# EAGLE design Tiny 5 Stick PTH -v2 (EAGLE 6.4)
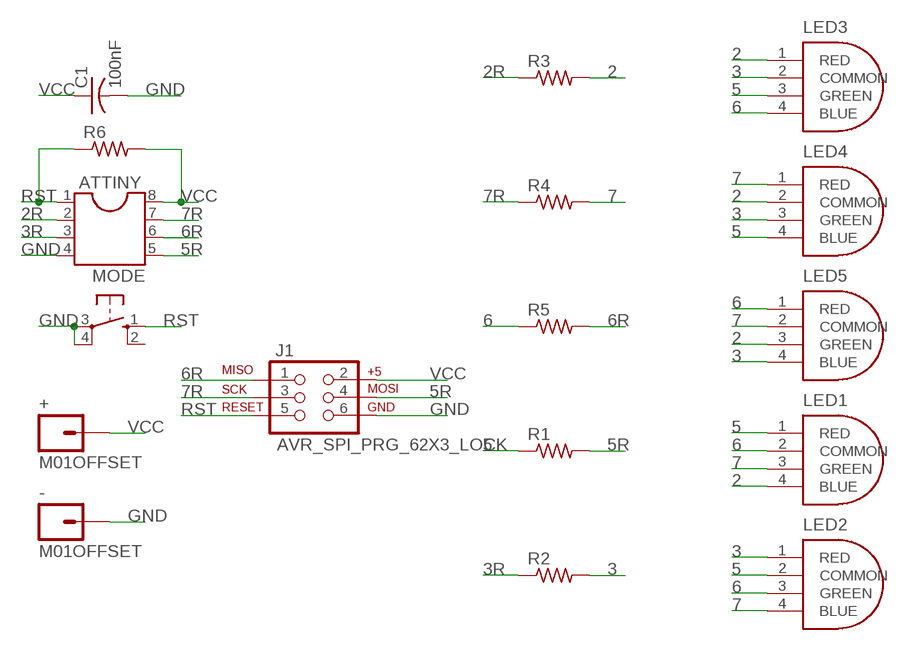
[diagram p0: schematic, sheet 1]

## Parts
+  M01OFFSET  [1X01_OFFSET]
-  M01OFFSET  [1X01_OFFSET]
ATTINY  DIL8S  [SOCKET-08]
C1  100nF  C-US025-025X050  [C025-025X050]
J1  AVR_SPI_PRG_62X3_LOCK  [2X3_LOCK]
LED1  10MM-RGB-LEDSEEED  [10MM-RGB-LED-SEEED-VALID]
LED2  10MM-RGB-LEDSEEED  [10MM-RGB-LED-SEEED-VALID]
LED3  10MM-RGB-LEDSEEED  [10MM-RGB-LED-SEEED-VALID]
LED4  10MM-RGB-LEDSEEED  [10MM-RGB-LED-SEEED-VALID]
LED5  10MM-RGB-LEDSEEED  [10MM-RGB-LED-SEEED-VALID]
MODE  10-XX  [B3F-10XX]
R1  R-US_0207/7  [0207/7]
R2  R-US_0207/7  [0207/7]
R3  R-US_0207/7  [0207/7]
R4  R-US_0207/7  [0207/7]
R5  R-US_0207/7  [0207/7]
R6  R-US_0207/2V  [0207/2V]

## Nets
2: LED1.4(BLUE) LED3.1(RED) LED4.2(COMMON) LED5.3(GREEN) R3.2
2R: ATTINY.2 R3.1
3: LED2.1(RED) LED3.2(COMMON) LED4.3(GREEN) LED5.4(BLUE) R2.2
3R: ATTINY.3 R2.1
5: LED1.1(RED) LED2.2(COMMON) LED3.3(GREEN) LED4.4(BLUE) R1.1
5R: ATTINY.5 J1.4 R1.2
6: LED1.2(COMMON) LED2.3(GREEN) LED3.4(BLUE) LED5.1(RED) R5.1
6R: ATTINY.6 J1.1 R5.2
7: LED1.3(GREEN) LED2.4(BLUE) LED4.1(RED) LED5.2(COMMON) R4.2
7R: ATTINY.7 J1.3 R4.1
GND: -.1 ATTINY.4 C1.2 J1.6 MODE.3(P) MODE.4(P1)
RST: ATTINY.1 J1.5 MODE.1(S) R6.1
VCC: +.1 ATTINY.8 C1.1 J1.2 R6.2
Unconnected: MODE.2(S1)

## Library data of the parts
+ - = SparkFun:M01: Header 1 Standard 1-pin 0.1" header. Use with straight break away headers (SKU : PRT-00116), right angle break away headers (PRT-00553), swiss pins (PRT-00743), machine pins (PRT-00117), and female headers (PRT-00115).
ATTINY = ic-package:DIL8: Dual In Line / Socket
C1 = adafruit:C-US: CAPACITOR, American symbol
J1 = SparkFun-Connectors:AVR_SPI_PRG_6: AVR ISP 6 Pin This is the reduced ISP connector for AVR programming. Common on Arduino. This footprint will take up less PCB space and can be used with a 10-pin to 6-pin adapter such as SKU: BOB-08508
LED1-LED5 = 00_rgbled:10MM-RGB-LED
MODE = switch-omron:10-XX: OMRON SWITCH; MPN: B3F-1000; OC_FARNELL: 176432; OC_NEWARK: 36M3542
R1-R6 = 00_PERSONAL:R-US_: RESISTOR, American symbol

## Net classes
0 default: clearance 0.355 mm

## Board
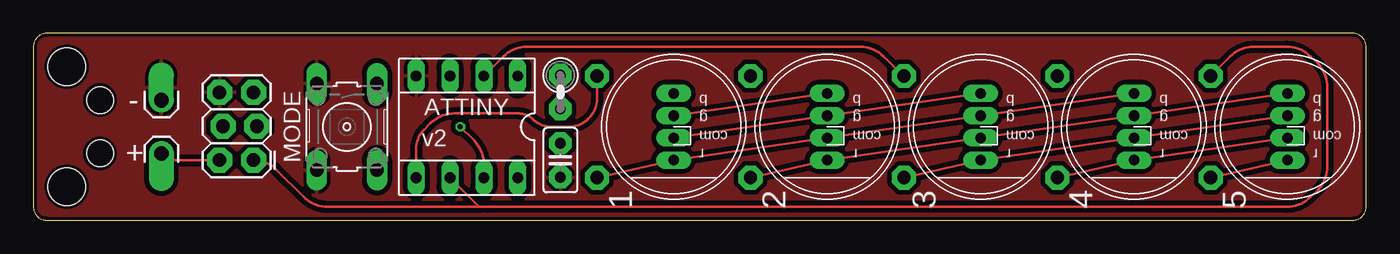
[diagram p1: board, top side]
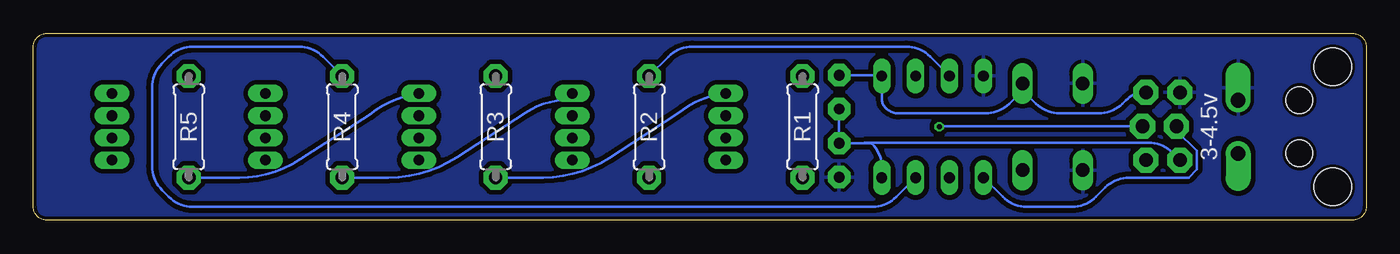
[diagram p2: board, bottom side, seen from below]

Size 99.9 x 14 mm. Coordinates in mm from the lower left corner, seen from the top.
Outline: 1,0 98.9,0 arc90 99.9,1 99.9,13 arc90 98.9,14 1,14 arc90 0,13 0,1 arc90 1,0
Copper layers (1*16): Top 0.035mm / dielectric 1.5mm / Bottom 0.035mm
Design rules "Fusion_eagle_rule_v1.1": minimum track width 6mil, minimum drill 12mil, track to track 6mil, track to pad 6mil, pad to pad 6mil, via to via 6mil, smd to smd 0mil, copper to edge 10mil, drill to drill 10mil, minimum pad ring 10mil, minimum via ring 6mil, stop-mask expansion 2mil, vias tented up to drill 100mil, thermal gap 10mil
Holes 2 mm at 5,5 5,9
Holes 2.8 mm at 2.5,2.5 2.5,11.5

### Footprints (pad centres in the part's own frame; a part is rotated, then mirrored left to right if it is on the bottom)
1X01_OFFSET = drill 1.118 pad 1.88 offset: 1 0,0
SOCKET-08 = drill 0.813 long: 1 -3.81,-3.81; 2 -1.27,-3.81; 3 1.27,-3.81; 4 3.81,-3.81; 5 3.81,3.81; 6 1.27,3.81; 7 -1.27,3.81; 8 -3.81,3.81
C025-025X050 = drill 0.813 pad 1.676 octagon: 1 -1.27,0; 2 1.27,0
2X3_LOCK = drill 1.016 pad 1.88 octagon: 1 0,0; 2 0,2.54; 3 2.54,-0.254; 4 2.54,2.286; 5 5.08,0; 6 5.08,2.54
10MM-RGB-LED-SEEED-VALID = drill 0.8 pad 0.889 long: 1 2.496,0; 2 0.832,0; 3 -0.832,0; 4 -2.496,0
B3F-10XX = drill 1.016 long: 1 -3.251,2.261; 2 3.251,2.261; 3 -3.251,-2.261; 4 3.251,-2.261
0207/7 = drill 1 pad 1.778 octagon: 1 -3.81,0; 2 3.81,0
0207/2V = drill 0.813 pad 1.676 octagon: 1 -1.27,0; 2 1.27,0

### Placement (x,y rotation side)
+  9.6,5 180 top
-  9.6,9 0 top
ATTINY  32.5,7 180 top
C1  39.5,4.5 270 top
J1  16.5,4.5 90 top
LED1  48,7 270 top
LED2  59.5,7 270 top
LED3  71,7 270 top
LED4  82.5,7 270 top
LED5  94,7 270 top
MODE  23.5,7 270 top
R1  42.25,7 90 bottom
R2  53.75,7 270 bottom
R3  65.25,7 270 bottom
R4  76.75,7 270 bottom
R5  88.25,7 90 bottom
R6  39.5,9.6 270 top

### Tracks (layer width: path | path; a pad name or v marks a point on that pad's centre or on a via)
2
  Top 0.203: R3.2 LED3.1 LED4.2 LED5.3
  Bottom 0.203: LED1.4 arc-33 51.68,7.95 56.75,4.66 arc33 61.68,3.2 R3.2
2R
  Top 0.203: R3.1 65.19,10.81 63.74,12.26 arc45 61.95,13 37.01,13 arc45 35.22,12.26 ATTINY.2
3
  Top 0.203: R2.2 LED2.1 LED3.2 LED4.3 LED5.4
3R
  Bottom 0.203: R2.1 52.3,12.26 arc45 50.51,13 34.47,13 arc45 32.68,12.26 ATTINY.3
5
  Top 0.203: R1.1 LED1.1 LED2.2 LED3.3 LED4.4
5R
  Top 0.203: R1.2 42.25,9.08 arc-45 41.66,7.66 41.59,7.59 arc-45 40.17,7 38.83,7 arc-45 37.41,7.59 arc45 36.41,8 31.55,8 arc45 29.76,7.26 29.29,6.79 arc45 28.7,5.37 ATTINY.5
  Bottom 0.203: ATTINY.5 27.24,1.74 arc-45 25.45,1 22.05,1 arc-45 20.26,1.74 19.54,2.46 arc45 17.75,3.2 13.3,3.2 12.7,3.8 12.7,5.2 14.21,6.71 J1.4
6
  Top 0.203: LED1.2 LED2.3 LED3.4 | R5.1 LED5.1
  Bottom 0.203: LED3.4 arc-32 74.68,7.92 79.91,4.55 arc33 84.49,3.2 R5.1
6R
  Top 0.203: R5.2 89.7,12.26 arc-45 91.49,13 93.95,13 arc-45 95.74,12.26 96.26,11.74 arc-45 97,9.95 97,4.05 arc-45 96.26,2.26 95.74,1.74 arc-45 93.95,1 34,1 33.42,1 | 33.42,1 ATTINY.6 | J1.1 arc-45 18.21,3.79 20.26,1.74 arc45 22.05,1 33.42,1
7
  Top 0.203: LED1.3 LED2.4 | R4.2 LED4.1 LED5.2
  Bottom 0.203: LED2.4 59.71,9.03 arc-33 63,8.06 68.15,4.72 arc33 73.3,3.2 R4.2
7R  (via drill 0.38)
  Top 0.203: v32,7 33.03,5.97 arc-45 33.77,4.18 ATTINY.7
  Bottom 0.203: R4.1 78.2,12.26 arc-45 79.99,13 87.95,13 arc-45 89.74,12.26 90.26,11.74 arc-45 91,9.95 91,4.05 arc-45 90.26,2.26 89.74,1.74 arc-45 87.95,1 37.01,1 arc-45 35.22,1.74 ATTINY.7 | J1.3 31.96,7.04 v32,7
GND
  pour Top (isolate 0.254): 1,14 arc90 0,13 0,1 arc90 1,0 98.99,0 arc90 99.99,1.01 100,1.01 100,13 arc90 99,14
  pour Bottom (isolate 0.254): 1,14 arc90 0,13 0,1 arc90 1,0 98.99,0 arc90 99.99,1.01 100,1.01 100,13 arc90 99,14
RST
  Bottom 0.203: R6.1 36.37,10.87 ATTINY.1 36.3,9.11 arc-45 36.01,8.41 arc-45 35.02,8 28.55,8 arc-45 26.76,8.74 25.76,9.74 MODE.1 25.76,9.76 24.74,8.74 arc-45 22.95,8 20.05,8 arc-45 18.26,8.74 18.01,8.99 arc45 16.59,9.58 J1.5
VCC
  Top 0.203: +.1 arc45 10.81,4.5 J1.2
  Bottom 0.203: R6.2 C1.1 37.6,5.77 | 37.6,5.77 37.07,5.77 37.04,5.74 arc45 36.3,3.95 ATTINY.8 | J1.2 14.52,5.06 arc-45 16.31,5.8 37.6,5.8 37.6,5.77

### Text on the board
tPlace: v2 | 1 | 2 | 3 | 4 | 5
bPlace: 3-4.5v
bStop: pfriedel | \\O_o/ | 2013